# Altium project Course_9.PrjPcb
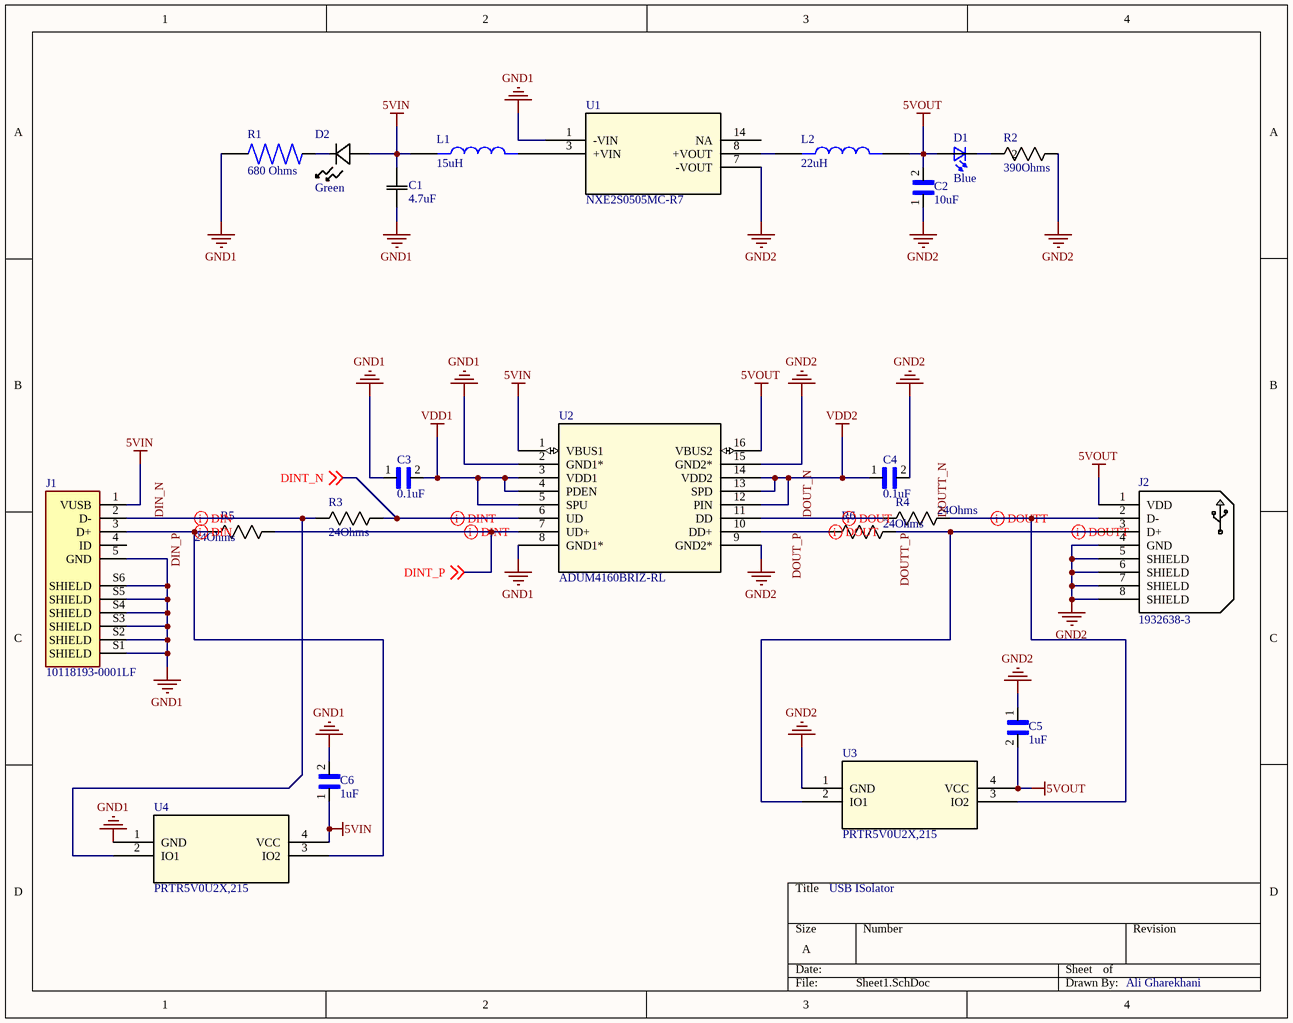
[diagram p0: Sheet1.SchDoc]
1 sheet, 22 parts. Net scope: global (net labels, ports and power ports of the same name join across sheets).
Board file: PCB1.PcbDoc

## Sheet Sheet1.SchDoc
size A; SheetNumber: 1; SheetTotal: 1

### Parts
C1  4.7uF  [CAP_CL31_SAM]
C2  10uF  [CAPC3216X140N]
C3  0.1uF  [CAPC1608X90N]
C4  0.1uF  [CAPC1608X90N]
C5  1uF  [CAPC1608X90]
C6  1uF  [CAPC1608X90]
D1  Blue  [0603]
D2  Green  [LED_LTST-C191KGKT_LTO]
J1  10118193-0001LF  [AMPHENOL_10118193-0001LF]
J2  1932638-3  [CONN4_1932638-3_TEC]
L1  15uH  [IND_VLCF4028T-150MR88-2]
L2  22uH  [IND_VLCF4024T-220MR65-2]
R1  680 Ohms  [RESC1608X55N]
R2  390Ohms  [RES_CRCW_0603]
R3  24Ohms  [RES_CRCW_0603]
R4  24Ohms  [RES_CRCW_0603]
R5  24Ohms  [RES_CRCW_0603]
R6  24Ohms  [RES_CRCW_0603]
U1  NXE2S0505MC-R7  [NXE2_SINGLE_SURFACE_MUR]
U2  ADUM4160BRIZ-RL  [RI_16_2_ADI]
U3  PRTR5V0U2X,215  [SOT143B_PRTR5V0U2X,215_NEX]
U4  PRTR5V0U2X,215  [SOT143B_PRTR5V0U2X,215_NEX]

### Nets
5VIN: C1.2 C6.1 D2.2(ANODE) J1.1(VUSB) L1.1 U2.1(VBUS1) U4.4(VCC)
5VOUT: C2.2 C5.2 D1.2(A2) J2.1(VDD) L2.2 U2.16(VBUS2) U3.4(VCC)
GND1: C1.1 C3.1 C6.2 J1.5(GND) J1.S1(SHIELD) J1.S2(SHIELD) J1.S3(SHIELD) J1.S4(SHIELD) J1.S5(SHIELD) J1.S6(SHIELD) R1.1 U1.1(-VIN) U2.2(GND1*) U2.8(GND1*) U4.1(GND)
GND2: C2.1 C4.2 C5.1 J2.4(GND) J2.5(SHIELD) J2.6(SHIELD) J2.7(SHIELD) J2.8(SHIELD) R2.1 U1.7(-VOUT) U2.9(GND2*) U2.15(GND2*) U3.1(GND)
VDD1: C3.2 U2.3(VDD1) U2.4(PDEN) U2.5(SPU)
VDD2: C4.1 U2.12(PIN) U2.13(SPD) U2.14(VDD2)
DIN_N: J1.2(D-) R3.2 U4.2(IO1)
DIN_P: J1.3(D+) R5.2 U4.3(IO2)
DINT_N: R3.1 U2.6(UD) ; off-sheet DINT_N
DINT_P: R5.1 U2.7(UD+) ; off-sheet DINT_P
DOUT_N: R4.2 U2.11(DD)
DOUT_P: R6.2 U2.10(DD+)
DOUTT_N: J2.2(D-) R4.1 U3.3(IO2)
DOUTT_P: J2.3(D+) R6.1 U3.2(IO1)
NetD1_1: D1.1(K2) R2.2
NetD2_1: D2.1(CATHODE) R1.2
NetL1_2: L1.2 U1.3(+VIN)
NetL2_1: L2.1 U1.8(+VOUT)

Not connected (* = marked no-connect by the designer): J1 4(ID); U1 14(NA)

### Layout directives
differential pair: DIN_N, DIN_P, DINT_N, DINT_P, DOUT_N, DOUT_P, DOUTT_N, DOUTT_P

### Notes on the sheet
- USB ISolator
- Ali Gharekhani

### Library data of the parts
C1 = CL31B475KOHNNNE: No Description Available; Mfr_Name: Samsung
C2 = CL31B106MOHNNNE: Package: None; Price: None; Value: *; MP: CL31B106MOHNNNE; Availability: Unavailable
C3 C4 = CL10B104KB8NNNL: 0.1ÂµF Â±10% 50V Ceramic Capacitor X7R 0603 _1608 Metric_; MF: Samsung Electro-Mechanics; MP: CL10B104KB8NNNL; SnapEDA_Link: https://www.snapeda.com/parts/CL10B104KB8NNNL/Samsung%20Electro-Mechanics/view-part/3598555/?ref=snap; Availability: Unavailable; Package: 0603 Samsung; Value: *; Price: None
C5 C6 = CC0603KRX5R8BB105: ÐšÐµÑ€Ð°Ð¼Ð¸Ñ‡ÐµÑÐºÐ¸Ð¹ ÐºÐ¾Ð½Ð´ÐµÐ½ÑÐ°Ñ‚Ð¾Ñ€ 1 Ð¼ÐºÐ¤ Â± 10% 25 Ð’ X5R 0603 _1608 Ð¼ÐµÑ‚Ñ€Ð¸Ñ‡ÐµÑÐºÐ¸Ñ…_; MF: Yageo; SnapEDA_Link: https://www.snapeda.com/parts/CC0603KRX5R8BB105/Yageo/view-part/1820893/?ref=snap; Package: 0603 Yageo; Price: None; Value: *; MP: CC0603KRX5R8BB105; Availability: Unavailable
D1 = LTST-C194TBKT: Blue 468nm LED Indication - Discrete 3.3V 0603 _1608 Metric_; MF: Lite-On Inc.; Package: 0603 Lite-On; Digi-Key_Part_Number: 160-1837-1-ND; MP: LTST-C194TBKT; Digi-Key_Purchase_URL: https://www.digikey.com/product-detail/en/lite-on-inc/LTST-C194TBKT/160-1837-1-ND/2356236?utm_source=snapeda&utm_medium=aggregator&utm_campaign=symbol; SnapEDA_Link: https://www.snapeda.com/parts/LTST-C194TBKT/Lite-On%20Inc./view-part/426592/?ref=snap; Value: *
D2 = LTST-C191KGKT: No Description Available; Mfr_Name: LITE-ON; Type: LED Indication
J1 = 10118193-0001LF: Micro USB 2.0, Input Output Connectors, B TYPE RECEPTACLE; MF: Amphenol ICC; Value: *; MP: 10118193-0001LF; Package: None; Check_prices: https://www.snapeda.com/parts/10118193-0001LF/Amphenol+FCI/view-part/?ref=eda; Purchase-URL: https://pricing.snapeda.com/search/part/10118193-0001LF/?ref=eda; Price: None; Availability: In Stock; SnapEDA_Link: https://www.snapeda.com/parts/10118193-0001LF/Amphenol+FCI/view-part/?ref=snap
J2 = 1932638-3: No Description Available; Mfr_Name: TE Connectivity; RefDes: RefDes; Type: Type
L1 = VLCF4028T-150MR88-2: SMD / SMT Inductor (Coil), 1.2 - 470 nH, 100 kHz, 0.25 - 3.11 A, 27 - 3980 Ohm, 4 x 4 x 2.8 (LxWxH); MF: TDK; SnapEDA_Link: https://www.snapeda.com/parts/VLCF4028T-150MR88-2/TDK/view-part/?ref=snap; Package: NON STANDARD-2 TDK; Value: *; MP: VLCF4028T-150MR88-2; Check_prices: https://www.snapeda.com/parts/VLCF4028T-150MR88-2/TDK/view-part/?ref=eda
L2 = VLCF4024T-220MR65-2: MF: {'manufacturer': u'TDK Corporation'}; Package: None; Price: None; Value: *; MP: VLCF4024T-220MR65-2; Availability: Unavailable
R1 = CR0603-JW-681ELF: Res Thick Film 0603 680 Ohm 5% 1/10W Â±200ppm/Â°C Molded SMD SMD Paper Tape on Plastic Reel; Package: None; Price: None; Value: *; MP: CR0603-JW-681ELF; Availability: Unavailable
R2 = CRCW0603390RFKEA: No Description Available; Mfr_Name: Vishay
R3-R6 = CRCW060324R0FKEA: No Description Available; Mfr_Name: Vishay
U1 = NXE2S0505MC-R7: No Description Available; Mfr_Name: Murata; Type: DC DC Converters; RefDes: RefDes
U2 = ADUM4160BRIZ-RL: No Description Available; Mfr_Name: Analog Devices Inc; RefDes: RefDes; Type: Type
U3 U4 = PRTR5V0U2X,215: No Description Available; Mfr_Name: Nexperia; RefDes: RefDes; Type: Type